# EAGLE schematic main (EAGLE 7.6.0)
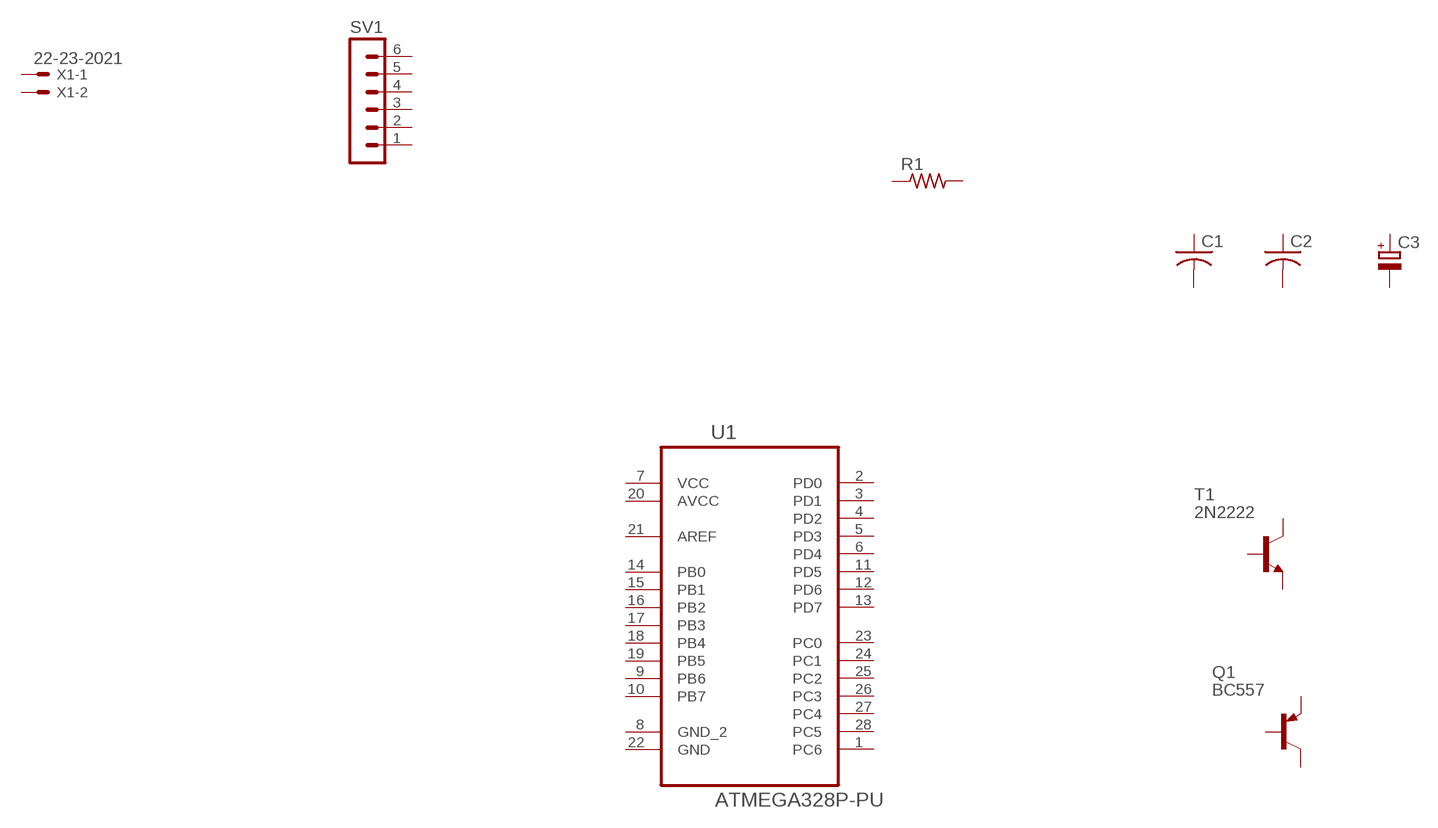
[diagram p0: schematic, sheet 1]

## Parts
C1  C-US050-025X075  [C050-025X075]
C2  C-US025-025X050  [C025-025X050]
C3  CPOL-EUE2.5-6  [E2,5-6]
Q1  BC557  [TO92-EBC]
R1  R-US_0207/10  [0207/10]
SV1  MA06-1  [MA06-1]
T1  2N2222  [TO92-EBC-OVAL]
U1  ATMEGA328P-PU  [DIP254P762X457-28]
X1  22-23-2021  [22-23-2021]
Unconnected: C1.1 C1.2 C2.1 C2.2 C3.+ C3.- Q1.B Q1.C Q1.E R1.1 R1.2 SV1.1 SV1.2 SV1.3 SV1.4 SV1.5 SV1.6 T1.B T1.C T1.E U1.1(PC6) U1.2(PD0) U1.3(PD1) U1.4(PD2) U1.5(PD3) U1.6(PD4) U1.8(GND_2) U1.9(PB6) U1.10(PB7) U1.11(PD5) U1.12(PD6) U1.13(PD7) U1.14(PB0) U1.15(PB1) U1.16(PB2) U1.17(PB3) U1.18(PB4) U1.19(PB5) U1.21(AREF) U1.22(GND) U1.23(PC0) U1.24(PC1) U1.25(PC2) U1.26(PC3) U1.27(PC4) U1.28(PC5) X1.1 X1.2

## Power pins joined to a net without a drawn wire
AVCC: U1.20(AVCC)
VCC: U1.7(VCC)

## Library data of the parts
C1 C2 = adafruit:C-US: CAPACITOR, American symbol
C3 = rcl:CPOL-EU: POLARIZED CAPACITOR, European symbol
Q1 = transistor-pnp:BC557*: PNP Transistror
R1 = adafruit:R-US_: RESISTOR, American symbol
SV1 = con-lstb:MA06-1: PIN HEADER; OC_FARNELL: unknown; OC_NEWARK: unknown
T1 = adafruit:2N2222: NPN TRANSISTOR Big oval pads
U1 = Atmel_By_element14_Batch_1-00:ATMEGA328P-PU: 8-bit Microcontroller with In-System Programmable Flash; MPN: ATMEGA328P-PU; OC_FARNELL: 1715487; OC_NEWARK: 15R0268; PACKAGE: PDIP-28; SUPPLIER: Atmel
X1 = con-molex:22-23-2021: .100" (2.54mm) Center Header - 2 Pin; MF: MOLEX; MPN: 22-23-2021; OC_FARNELL: 1462926; OC_NEWARK: 25C3832